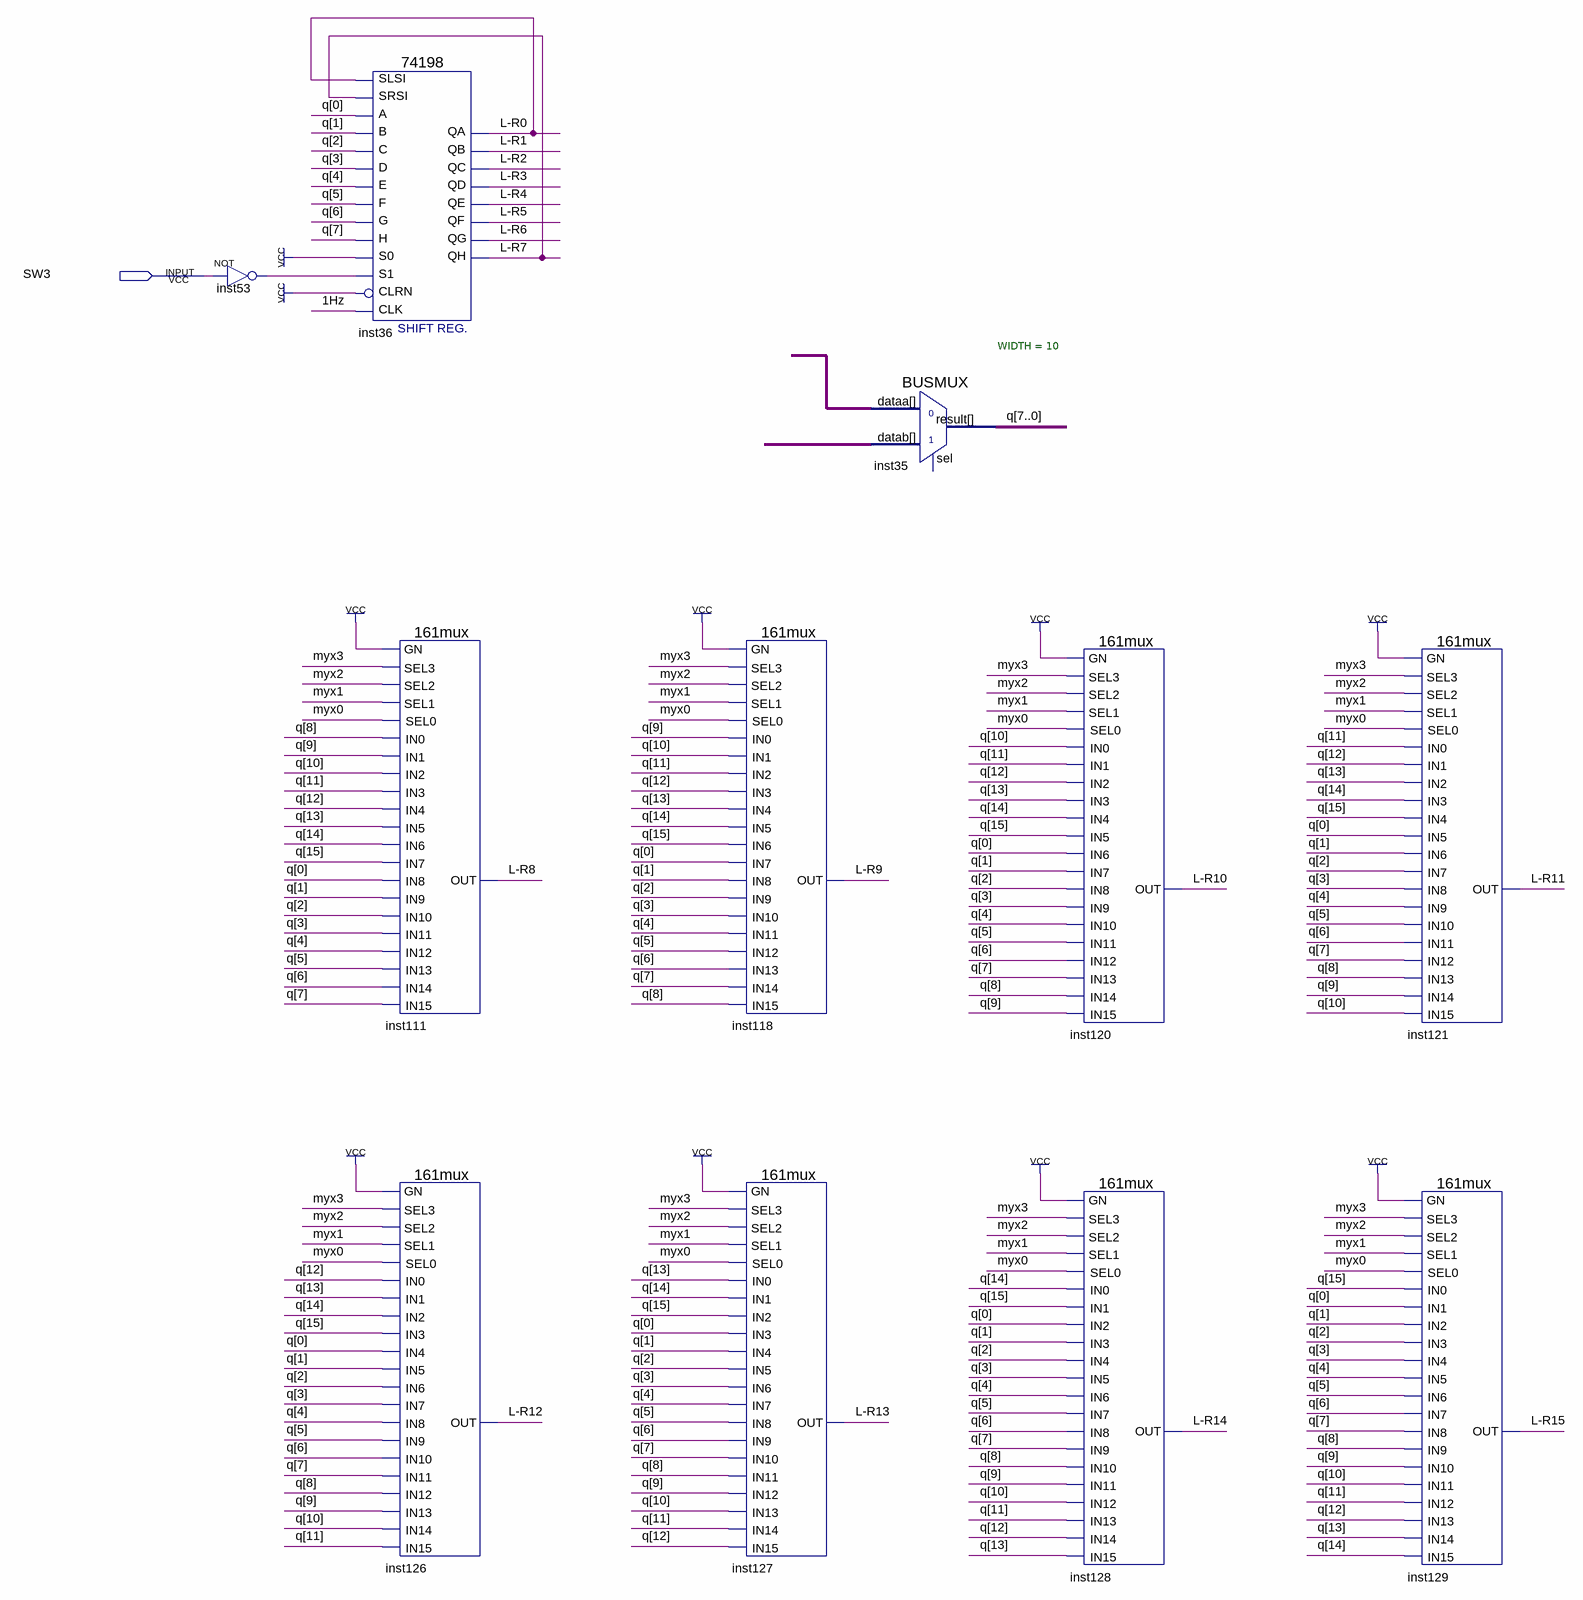
[diagram p0: schematic sheet]
// Quartus schematic test.bdf as structural Verilog: 11 symbols, 1 pins
module test (
  input  SW3
);

  wire \1Hz , inst53_out, \L-R0 , \L-R1 , \L-R2 , \L-R3 , \L-R4 , \L-R5 , \L-R6 , \L-R7 , \L-R8 , \L-R9 ,
       \L-R10 , \L-R11 , \L-R12 , \L-R13 , \L-R14 , \L-R15 , myx0, myx1, myx2, myx3;
  wire [9:0] undriven, undriven_2;
  wire [15:0] q;

  not inst53 (inst53_out, SW3);
  \74198  inst36 (
    .A(q[0]), .SRSI(\L-R7 ), .SLSI(\L-R0 ), .E(q[4]), .S0(1'b1), .B(q[1]), .C(q[2]), .D(q[3]), .H(q[7]),
    .G(q[6]), .CLRN(1'b1), .CLK(\1Hz ), .F(q[5]), .S1(inst53_out), .QD(\L-R3 ), .QC(\L-R2 ), .QH(\L-R7 ),
    .QA(\L-R0 ), .QB(\L-R1 ), .QE(\L-R4 ), .QF(\L-R5 ), .QG(\L-R6 ));
  \161mux  inst111 (
    .SEL3(myx3), .GN(1'b1), .IN0(q[8]), .SEL0(myx0), .SEL1(myx1), .SEL2(myx2), .IN3(q[11]), .IN2(q[10]),
    .IN1(q[9]), .IN6(q[14]), .IN5(q[13]), .IN4(q[12]), .IN9(q[1]), .IN8(q[0]), .IN7(q[15]), .IN11(q[3]),
    .IN12(q[4]), .IN10(q[2]), .IN15(q[7]), .IN14(q[6]), .IN13(q[5]), .OUT(\L-R8 ));
  \161mux  inst126 (
    .SEL3(myx3), .GN(1'b1), .IN0(q[12]), .SEL0(myx0), .SEL1(myx1), .SEL2(myx2), .IN3(q[15]), .IN2(q[14]),
    .IN1(q[13]), .IN6(q[2]), .IN5(q[1]), .IN4(q[0]), .IN9(q[5]), .IN8(q[4]), .IN7(q[3]), .IN11(q[7]),
    .IN12(q[8]), .IN10(q[6]), .IN15(q[11]), .IN14(q[10]), .IN13(q[9]), .OUT(\L-R12 ));
  \161mux  inst118 (
    .SEL3(myx3), .GN(1'b1), .IN0(q[9]), .SEL0(myx0), .SEL1(myx1), .SEL2(myx2), .IN3(q[12]), .IN2(q[11]),
    .IN1(q[10]), .IN6(q[15]), .IN5(q[14]), .IN4(q[13]), .IN9(q[2]), .IN8(q[1]), .IN7(q[0]), .IN11(q[4]),
    .IN12(q[5]), .IN10(q[3]), .IN15(q[8]), .IN14(q[7]), .IN13(q[6]), .OUT(\L-R9 ));
  \161mux  inst127 (
    .SEL3(myx3), .GN(1'b1), .IN0(q[13]), .SEL0(myx0), .SEL1(myx1), .SEL2(myx2), .IN3(q[0]), .IN2(q[15]),
    .IN1(q[14]), .IN6(q[3]), .IN5(q[2]), .IN4(q[1]), .IN9(q[6]), .IN8(q[5]), .IN7(q[4]), .IN11(q[8]),
    .IN12(q[9]), .IN10(q[7]), .IN15(q[12]), .IN14(q[11]), .IN13(q[10]), .OUT(\L-R13 ));
  BUSMUX #(.WIDTH(10)) inst35 (.datab(undriven_2), .dataa(undriven), .result(q[7:0]));  // open: sel
  \161mux  inst120 (
    .SEL3(myx3), .GN(1'b1), .IN0(q[10]), .SEL0(myx0), .SEL1(myx1), .SEL2(myx2), .IN3(q[13]), .IN2(q[12]),
    .IN1(q[11]), .IN6(q[0]), .IN5(q[15]), .IN4(q[14]), .IN9(q[3]), .IN8(q[2]), .IN7(q[1]), .IN11(q[5]),
    .IN12(q[6]), .IN10(q[4]), .IN15(q[9]), .IN14(q[8]), .IN13(q[7]), .OUT(\L-R10 ));
  \161mux  inst128 (
    .SEL3(myx3), .GN(1'b1), .IN0(q[14]), .SEL0(myx0), .SEL1(myx1), .SEL2(myx2), .IN3(q[1]), .IN2(q[0]),
    .IN1(q[15]), .IN6(q[4]), .IN5(q[3]), .IN4(q[2]), .IN9(q[7]), .IN8(q[6]), .IN7(q[5]), .IN11(q[9]),
    .IN12(q[10]), .IN10(q[8]), .IN15(q[13]), .IN14(q[12]), .IN13(q[11]), .OUT(\L-R14 ));
  \161mux  inst121 (
    .SEL3(myx3), .GN(1'b1), .IN0(q[11]), .SEL0(myx0), .SEL1(myx1), .SEL2(myx2), .IN3(q[14]), .IN2(q[13]),
    .IN1(q[12]), .IN6(q[1]), .IN5(q[0]), .IN4(q[15]), .IN9(q[4]), .IN8(q[3]), .IN7(q[2]), .IN11(q[6]),
    .IN12(q[7]), .IN10(q[5]), .IN15(q[10]), .IN14(q[9]), .IN13(q[8]), .OUT(\L-R11 ));
  \161mux  inst129 (
    .SEL3(myx3), .GN(1'b1), .IN0(q[15]), .SEL0(myx0), .SEL1(myx1), .SEL2(myx2), .IN3(q[2]), .IN2(q[1]),
    .IN1(q[0]), .IN6(q[5]), .IN5(q[4]), .IN4(q[3]), .IN9(q[8]), .IN8(q[7]), .IN7(q[6]), .IN11(q[10]),
    .IN12(q[11]), .IN10(q[9]), .IN15(q[14]), .IN14(q[13]), .IN13(q[12]), .OUT(\L-R15 ));
endmodule
